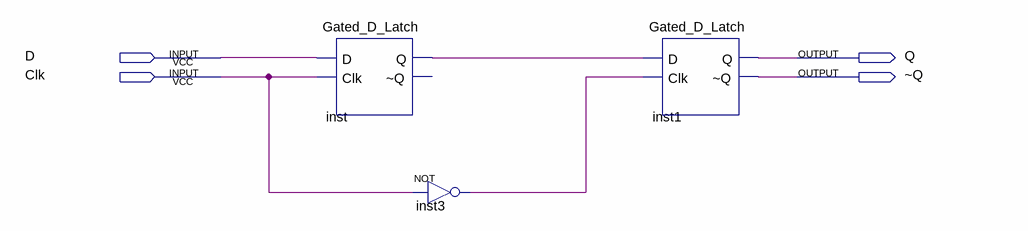
[diagram p0: schematic sheet]
// Quartus schematic Negative_Edge_MSDFF.bdf as structural Verilog: 3 symbols, 4 pins
module Negative_Edge_MSDFF (
  input  D,
  input  Clk,
  output Q,
  output \~Q 
);

  wire inst3_out, inst_q;

  Gated_D_Latch inst (.D(D), .Clk(Clk), .Q(inst_q));  // open: ~Q
  not inst3 (inst3_out, Clk);
  Gated_D_Latch inst1 (.D(inst_q), .Clk(inst3_out), .Q(Q), .\~Q (\~Q ));
endmodule
